# Altium schematic sheet ESC_A.SchDoc
size A3; SheetNumber: 7; SheetTotal: 10
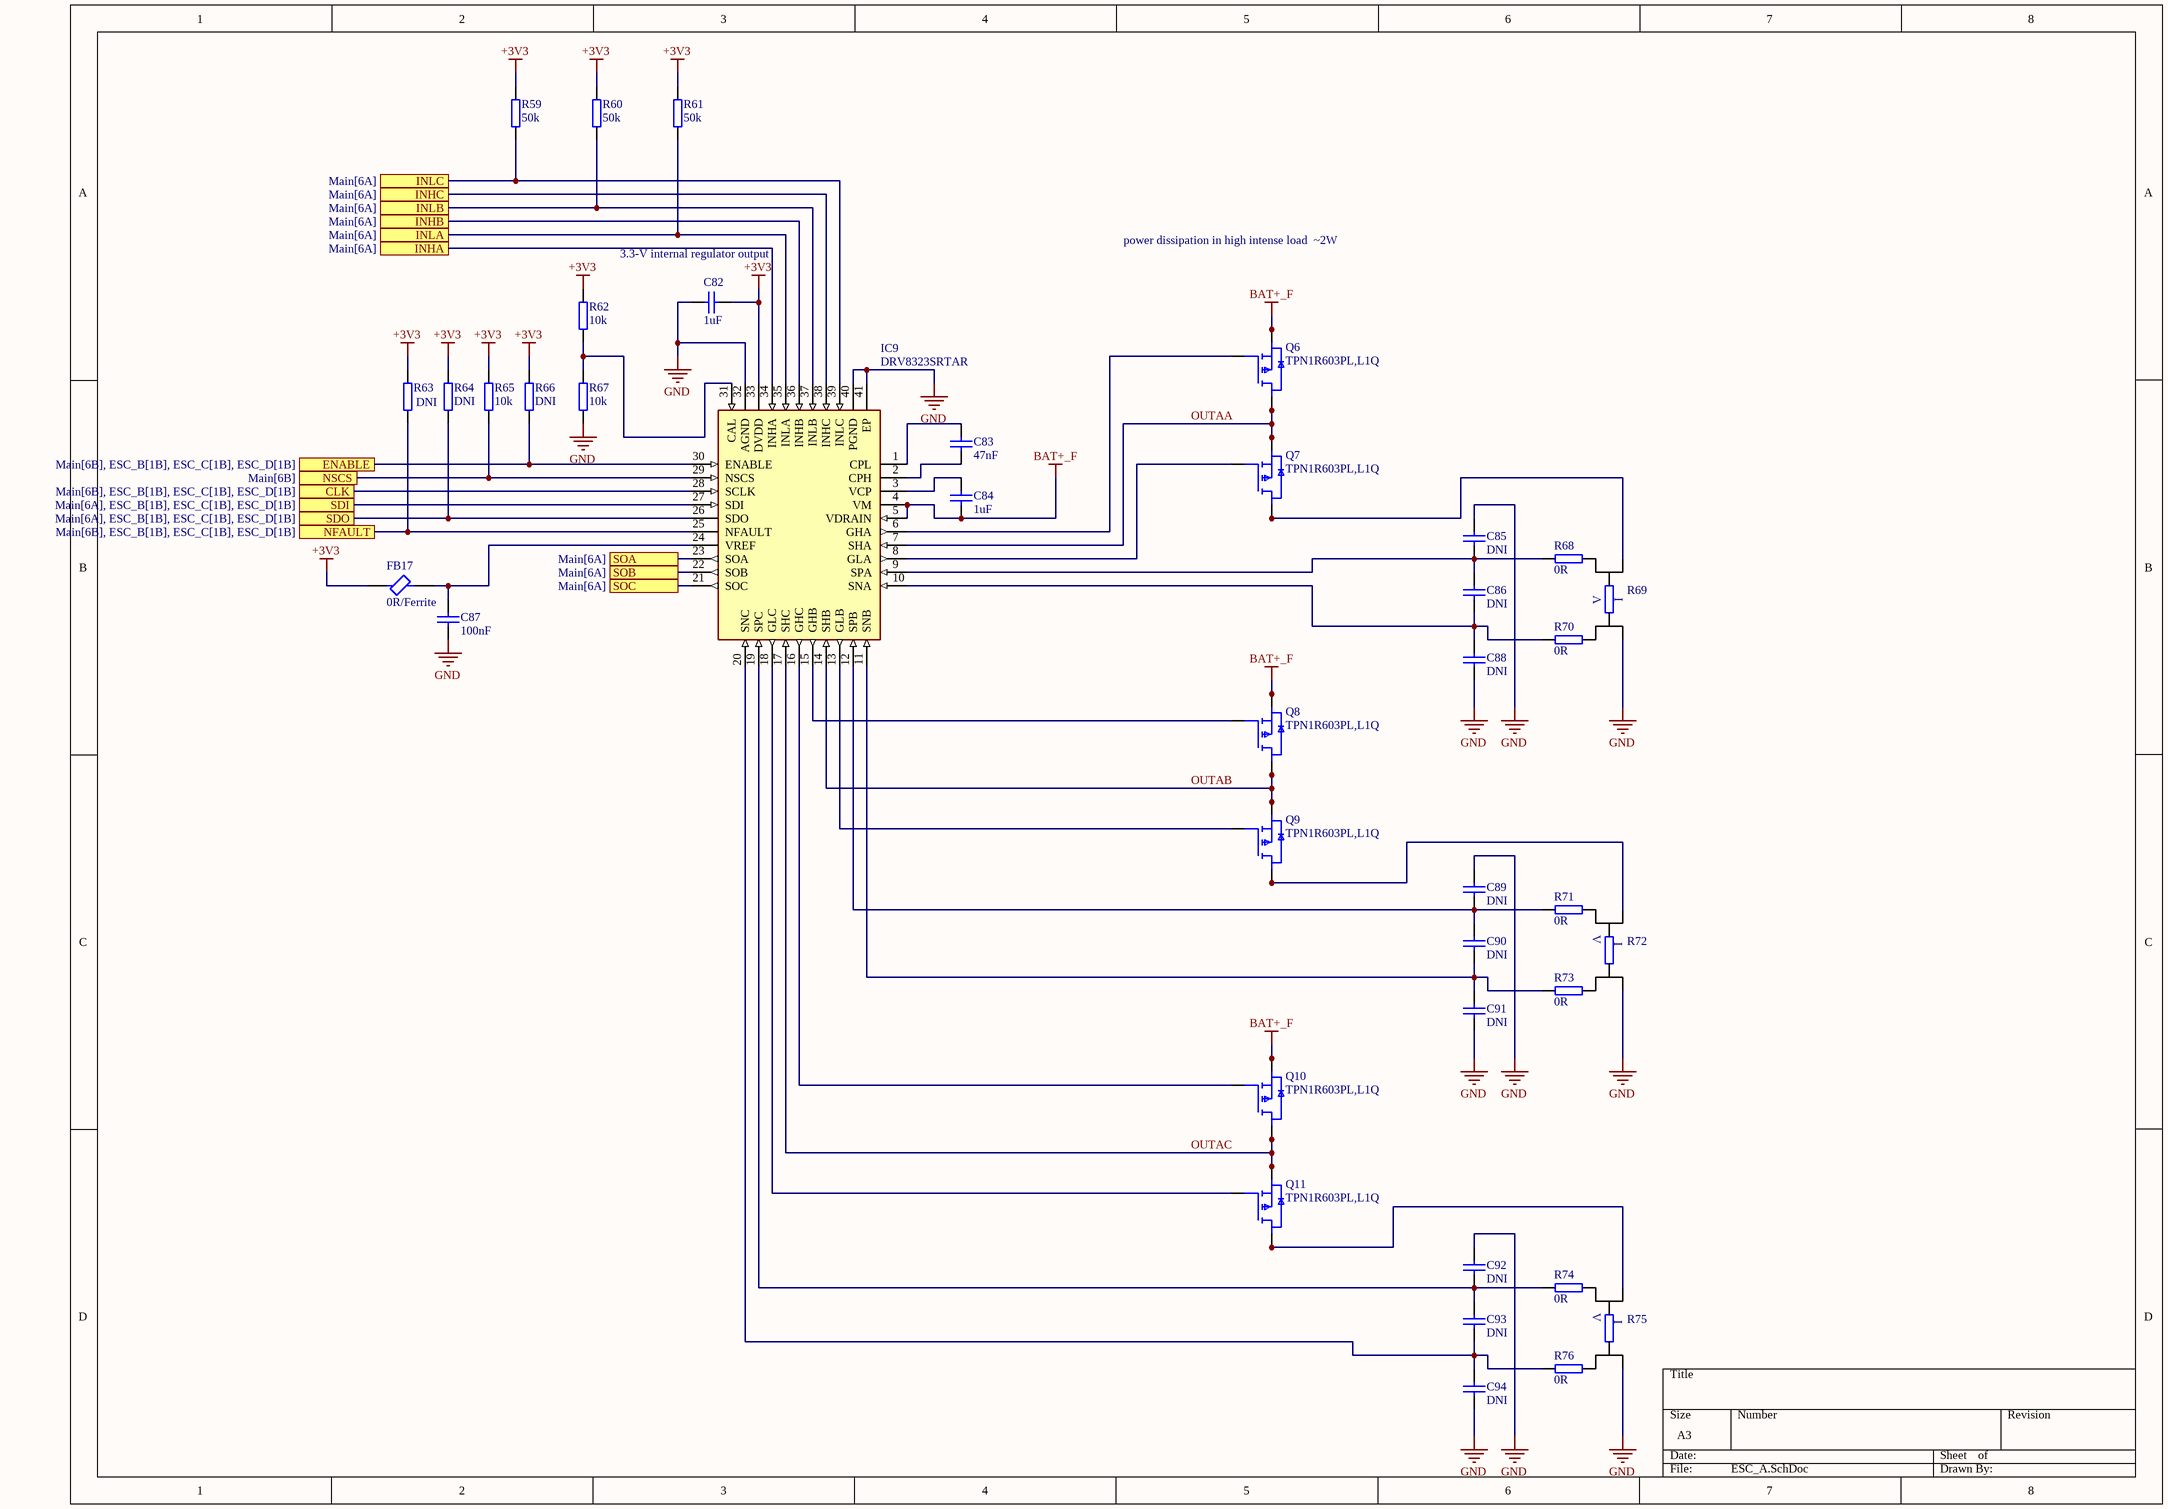
[diagram p0: ESC_A.SchDoc]

## Parts
C82  value 1uF  [CAP0402]  (hidden comment: Cap0402)
C83  value 47nF  [CAP0603]  (hidden comment: CapSMD0603)
C84  value 1uF  [CAP0603]  (hidden comment: CapSMD0603)
C85  value DNI  [CAP0402]  (hidden comment: Cap0402)
C86  value DNI  [CAP0402]  (hidden comment: Cap0402)
C87  value 100nF  [CAP0402]  (hidden comment: Cap0402)
C88  value DNI  [CAP0402]  (hidden comment: Cap0402)
C89  value DNI  [CAP0402]  (hidden comment: Cap0402)
C90  value DNI  [CAP0402]  (hidden comment: Cap0402)
C91  value DNI  [CAP0402]  (hidden comment: Cap0402)
C92  value DNI  [CAP0402]  (hidden comment: Cap0402)
C93  value DNI  [CAP0402]  (hidden comment: Cap0402)
C94  value DNI  [CAP0402]  (hidden comment: Cap0402)
FB17  0R/Ferrite  [NFZ15SG152SN10B]
IC9  DRV8323SRTAR  [QFN50P600X600X80-41N-D]
Q6  TPN1R603PL,L1Q  [TPN1R603PLL1Q]
Q7  TPN1R603PL,L1Q  [TPN1R603PLL1Q]
Q8  TPN1R603PL,L1Q  [TPN1R603PLL1Q]
Q9  TPN1R603PL,L1Q  [TPN1R603PLL1Q]
Q10  TPN1R603PL,L1Q  [TPN1R603PLL1Q]
Q11  TPN1R603PL,L1Q  [TPN1R603PLL1Q]
R59  value 50k  [RES0402]  (hidden comment: Res0402)
R60  value 50k  [RES0402]  (hidden comment: Res0402)
R61  value 50k  [RES0402]  (hidden comment: Res0402)
R62  value 10k  [RES0402]  (hidden comment: Res0402)
R63  value DNI  [RES0402]  (hidden comment: Res0402)
R64  value DNI  [RES0402]  (hidden comment: Res0402)
R65  value 10k  [RES0402]  (hidden comment: Res0402)
R66  value DNI  [RES0402]  (hidden comment: Res0402)
R67  value 10k  [RES0402]  (hidden comment: Res0402)
R68  value 0R  [RES0402]  (hidden comment: Res0402)
R69  WSK12161L000FEA  [WSK12161L000FEA]  (value not drawn)
R70  value 0R  [RES0402]  (hidden comment: Res0402)
R71  value 0R  [RES0402]  (hidden comment: Res0402)
R72  WSK12161L000FEA  [WSK12161L000FEA]  (value not drawn)
R73  value 0R  [RES0402]  (hidden comment: Res0402)
R74  value 0R  [RES0402]  (hidden comment: Res0402)
R75  WSK12161L000FEA  [WSK12161L000FEA]  (value not drawn)
R76  value 0R  [RES0402]  (hidden comment: Res0402)

## Ports
CLK (see Main[6B], ESC_B[1B], ESC_C[1B], ESC_D[1B]), ENABLE (see Main[6B], ESC_B[1B], ESC_C[1B], ESC_D[1B]), INHA (see Main[6A]), INHB (see Main[6A]), INHC (see Main[6A]), INLA (see Main[6A]), INLB (see Main[6A]), INLC (see Main[6A]), NFAULT (see Main[6B], ESC_B[1B], ESC_C[1B], ESC_D[1B]), NSCS (see Main[6B]), SDI (see Main[6A], ESC_B[1B], ESC_C[1B], ESC_D[1B]), SDO (see Main[6A], ESC_B[1B], ESC_C[1B], ESC_D[1B]), SOA (see Main[6A]), SOB (see Main[6A]), SOC (see Main[6A])

## Nets
+3V3: C82.2 FB17.1 IC9.33(DVDD) R59.2 R60.2 R61.2 R62.2 R63.2 R64.2 R65.2 R66.2
BAT+_F: C84.1 IC9.4(VM) IC9.5(VDRAIN) Q6.1(S_1) Q6.2(S_2) Q6.3(S_3) Q8.1(S_1) Q8.2(S_2) Q8.3(S_3) Q10.1(S_1) Q10.2(S_2) Q10.3(S_3)
GND: C82.1 C85.1 C87.1 C88.2 C89.1 C91.2 C92.1 C94.2 IC9.32(AGND) IC9.40(PGND) IC9.41(EP) R67.1 R69.1 R72.4 R75.4
CLK: IC9.28(SCLK) ; port CLK
ENABLE: IC9.30(ENABLE) R66.1 ; port ENABLE
INHA: IC9.34(INHA) ; port INHA
INHB: IC9.36(INHB) ; port INHB
INHC: IC9.38(INHC) ; port INHC
INLA: IC9.35(INLA) R61.1 ; port INLA
INLB: IC9.37(INLB) R60.1 ; port INLB
INLC: IC9.39(INLC) R59.1 ; port INLC
NFAULT: IC9.25(NFAULT) R63.1 ; port NFAULT
NSCS: IC9.29(NSCS) R65.1 ; port NSCS
OUTAA: IC9.7(SHA) Q6.5(D_1) Q6.6(D_2) Q6.7(D_3) Q6.8(D_4) Q6.9(D_4) Q7.1(S_1) Q7.2(S_2) Q7.3(S_3)
OUTAB: IC9.14(SHB) Q8.5(D_1) Q8.6(D_2) Q8.7(D_3) Q8.8(D_4) Q8.9(D_4) Q9.1(S_1) Q9.2(S_2) Q9.3(S_3)
OUTAC: IC9.17(SHC) Q10.5(D_1) Q10.6(D_2) Q10.7(D_3) Q10.8(D_4) Q10.9(D_4) Q11.1(S_1) Q11.2(S_2) Q11.3(S_3)
SDI: IC9.27(SDI) ; port SDI
SDO: IC9.26(SDO) R64.1 ; port SDO
SOA: IC9.23(SOA) ; port SOA
SOB: IC9.22(SOB) ; port SOB
SOC: IC9.21(SOC) ; port SOC
NetC83_1: C83.1 IC9.2(CPH)
NetC83_2: C83.2 IC9.1(CPL)
NetC84_2: C84.2 IC9.3(VCP)
NetC85_2: C85.2 C86.1 IC9.9(SPA) R68.1
NetC86_2: C86.2 C88.1 IC9.10(SNA) R70.1
NetC87_2: C87.2 FB17.2 IC9.24(VREF)
NetC89_2: C89.2 C90.1 IC9.12(SPB) R71.1
NetC90_2: C90.2 C91.1 IC9.11(SNB) R73.1
NetC92_2: C92.2 C93.1 IC9.19(SPC) R74.1
NetC93_2: C93.2 C94.1 IC9.20(SNC) R76.1
NetIC9_6: IC9.6(GHA) Q6.4(G)
NetIC9_8: IC9.8(GLA) Q7.4(G)
NetIC9_13: IC9.13(GLB) Q9.4(G)
NetIC9_15: IC9.15(GHB) Q8.4(G)
NetIC9_16: IC9.16(GHC) Q10.4(G)
NetIC9_18: IC9.18(GLC) Q11.4(G)
NetIC9_31: IC9.31(CAL) R62.1 R67.2
NetQ7_5: Q7.5(D_1) Q7.6(D_2) Q7.7(D_3) Q7.8(D_4) Q7.9(D_4) R69.4
NetQ9_5: Q9.5(D_1) Q9.6(D_2) Q9.7(D_3) Q9.8(D_4) Q9.9(D_4) R72.1
NetQ11_5: Q11.5(D_1) Q11.6(D_2) Q11.7(D_3) Q11.8(D_4) Q11.9(D_4) R75.1
NetR68_2: R68.2 R69.3
NetR69_2: R69.2 R70.2
NetR71_2: R71.2 R72.2
NetR72_3: R72.3 R73.2
NetR74_2: R74.2 R75.2
NetR75_3: R75.3 R76.2

## Notes on the sheet
- power dissipation in high intense load  ~2W
- 3.3-V internal regulator output
- (near IC9) Separate grounds?
- (in symbol WSK1216L5000FEA) I; V

## Library data of the parts
C82 = Cap0402: Voltage: val
C83 C84 = CapSMD0603: 50V; Published: 8-Jun-2000; LatestRevisionDate: 29-May-2009; LatestRevisionNote: IPC-7351 Footprint Added.; PackageReference: C1206; Publisher: Altium Limited; PackageDescription: Chip Capacitor
C87 = Cap0402: Voltage: 6V3
FB17 = BLM15PE471SH1D: Ferrite Bead; Manufacturer_Name: Murata Electronics; Datasheet Link: https://www.murata.com/en-global/products/productdetail.aspx?cate=luNoiseSupprFilteChipFerriBead&partno=BLM15PE471SH1%23; Height: 0.55mm; Manufacturer_Part_Number: BLM15PE471SH1D; Mouser Part Number: 81-BLM15PE471SH1D; Mouser Price/Stock: https://www.mouser.co.uk/ProductDetail/Murata-Electronics/BLM15PE471SH1D?qs=DRkmTr78QATAY5qAVx1hGA%3D%3D
IC9 = DRV8323SRTAR: Integrated Circuit; Manufacturer_Name: Texas Instruments; Datasheet Link: http://www.ti.com/lit/ds/symlink/drv8323.pdf; Height: 0.8mm; Manufacturer_Part_Number: DRV8323SRTAR; Mouser Part Number: 595-DRV8323SRTAR; Mouser Price/Stock: https://www.mouser.co.uk/ProductDetail/Texas-Instruments/DRV8323SRTAR?qs=u4fy%2FsgLU9P2gpPTX6mffg%3D%3D; Arrow Part Number: DRV8323SRTAR; Arrow Price/Stock: https://www.arrow.com/en/products/drv8323srtar/texas-instruments?utm_currency=USD&region=nac
Q6-Q11 = TPN1R603PL,L1Q: MOSFET (N-Channel); Manufacturer_Name: Toshiba; Datasheet Link: https://toshiba.semicon-storage.com/ap-en/semiconductor/product/mosfets/12v-300v-mosfets/detail.TPN1R603PL.html; Height: 0.9mm; Manufacturer_Part_Number: TPN1R603PL,L1Q; Mouser Part Number: 757-TPN1R603PLL1Q; Mouser Price/Stock: https://www.mouser.co.uk/ProductDetail/Toshiba/TPN1R603PLL1Q?qs=bUPhaerQQeGYpGlYi%252BLguw%3D%3D; Arrow Part Number: TPN1R603PL,L1Q; Arrow Price/Stock: https://www.arrow.com/en/products/tpn1r603pll1q/toshiba?utm_currency=USD&region=nac
R69 R72 R75 = WSK1216L5000FEA: Resistor; Manufacturer_Name: Vishay; Datasheet Link: http://www.vishay.com/docs/30189/wsk1216.pdf; Height: 1.9mm; Manufacturer_Part_Number: WSK1216L5000FEA; Mouser Part Number: 71-WSK1216L5000FEA; Mouser Price/Stock: https://www.mouser.co.uk/ProductDetail/Vishay-Dale/WSK1216L5000FEA?qs=OlC7AqGiEDlM2wGD42LFoQ%3D%3D; Arrow Part Number: WSK1216L5000FEA; Arrow Price/Stock: https://www.arrow.com/en/products/wsk1216l5000fea/vishay?region=nac
C85 C86 C88-C94 = Cap0402: Voltage: DNI